# EAGLE design FoneAstra3.2 (EAGLE 6.3)

## Sheet 1 of 2
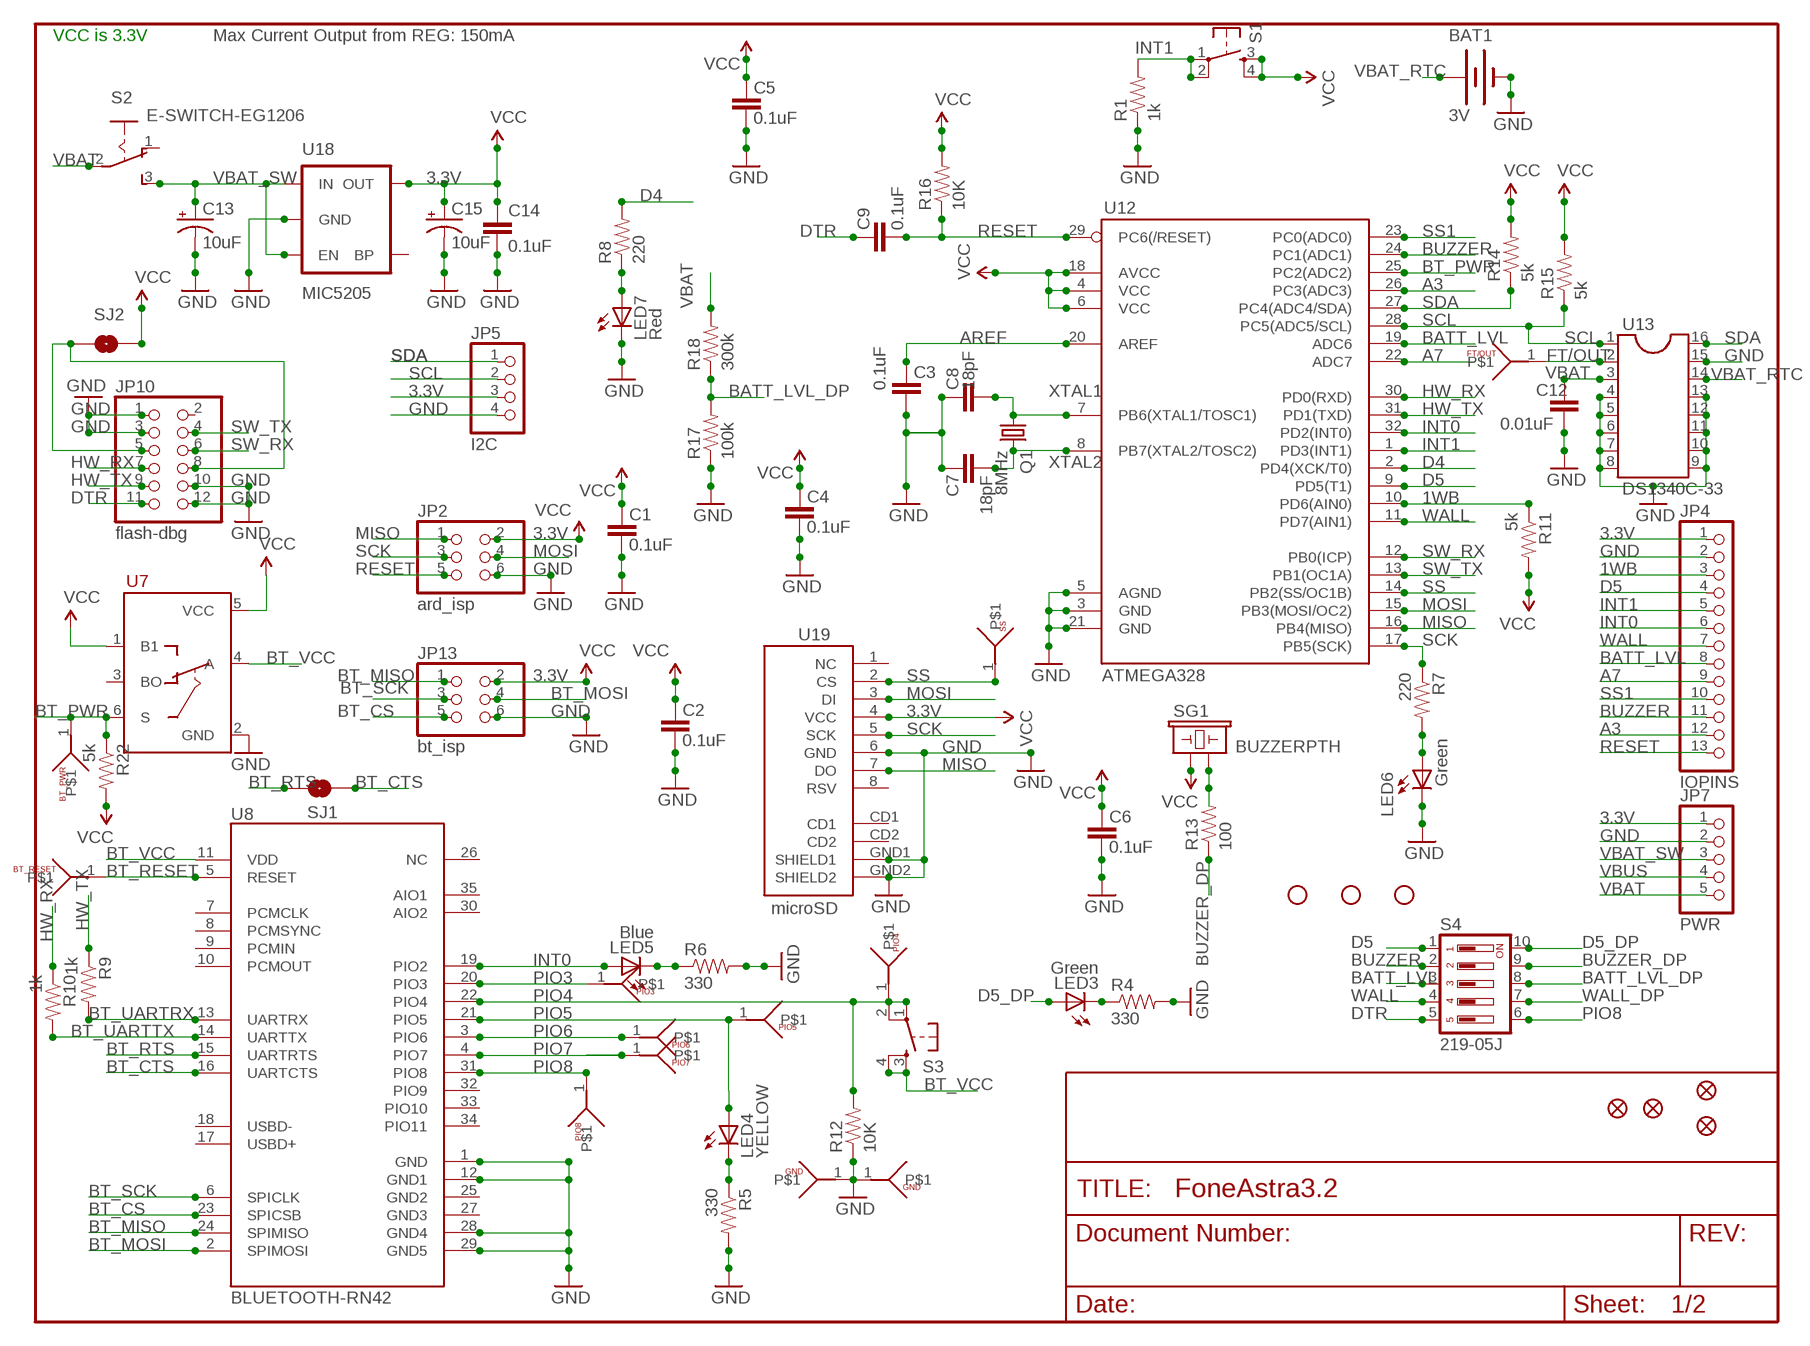
[diagram p0: schematic, sheet 1, part 1 of 2]
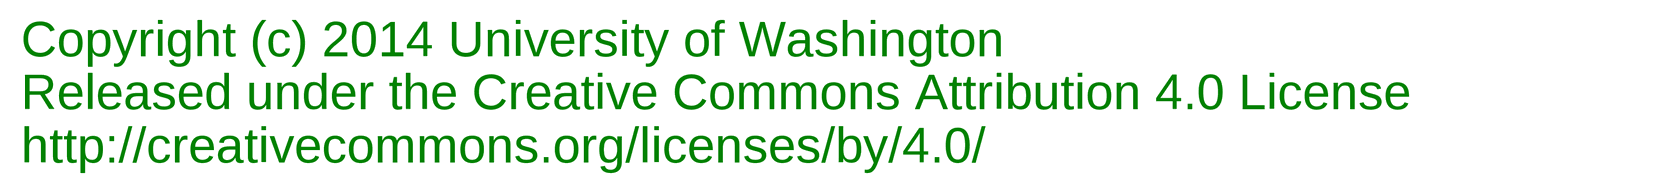
[diagram p1: schematic, sheet 1, part 2 of 2]

### Parts
$$U3  BT_RESET  TESTPOINT  [TESTPOINT]
$$U4  PIO6  TESTPOINT  [TESTPOINT]
$$U5  PIO7  TESTPOINT  [TESTPOINT]
$$U6  GND  TESTPOINT  [TESTPOINT]
$$U9  PIO4  TESTPOINT  [TESTPOINT]
$$U10  PIO3  TESTPOINT  [TESTPOINT]
$$U11  PIO5  TESTPOINT  [TESTPOINT]
$$U15  FT/OUT  TESTPOINT  [TESTPOINT]
$$U16  GND  TESTPOINT  [TESTPOINT]
BAT1  3V  BATTERY  [BATTCON_12MM_CURVED]
BT_PWR  BT_PWR  TESTPOINT  [TESTPOINT]
C1  0.1uF  CAP0402-CAP  [0402-CAP]
C2  0.1uF  CAP0402-CAP  [0402-CAP]
C3  0.1uF  CAP0402-CAP  [0402-CAP]
C4  0.1uF  CAP0402-CAP  [0402-CAP]
C5  0.1uF  CAP0402-CAP  [0402-CAP]
C6  0.1uF  CAP0402-CAP  [0402-CAP]
C7  18pF  CAP0402-CAP  [0402-CAP]
C8  18pF  CAP0402-CAP  [0402-CAP]
C9  0.1uF  CAP0402-CAP  [0402-CAP]
C12  0.01uF  CAP0402-CAP  [0402-CAP]
C13  10uF  CAP_POL1206  [EIA3216]
C14  0.1uF  CAP0402-CAP  [0402-CAP]
C15  10uF  CAP_POL1206  [EIA3216]
JP1  SPARKFUN_FIDUCIAL1.5X3  [SPARKFUN_FIDUCIAL-1.5X3]
JP2  ard_isp  PINHD-2X3  [2X03]
JP3  STAND-OFFTIGHT  [STAND-OFF-TIGHT]
JP4  IOPINS  PINHD-1X13M  [1X13M]
JP5  I2C  PINHD-1X4M  [1X04M]
JP6  STAND-OFFTIGHT  [STAND-OFF-TIGHT]
JP7  PWR  PINHD-1X5M  [1X05M]
JP8  SPARKFUN_FIDUCIAL1.5X3  [SPARKFUN_FIDUCIAL-1.5X3]
JP9  STAND-OFFTIGHT  [STAND-OFF-TIGHT]
JP10  flash-dbg  PINHD-2X6  [2X06]
JP11  SPARKFUN_FIDUCIAL1.5X3  [SPARKFUN_FIDUCIAL-1.5X3]
JP13  bt_isp  PINHD-2X3  [2X03]
JP14  SPARKFUN_FIDUCIAL1.5X3  [SPARKFUN_FIDUCIAL-1.5X3]
LED3  Green  LED0603  [LED-0603]
LED4  YELLOW  LED0603  [LED-0603]
LED5  Blue  LED0603  [LED-0603]
LED6  Green  LED0603  [LED-0603]
LED7  Red  LED0603  [LED-0603]
PIO8  PIO8  TESTPOINT  [TESTPOINT]
Q1  8MHz  CRYSTALHC49S  [HC49/S]
R1  1k  RESISTOR0402-RES  [0402-RES]
R4  330  RESISTOR0402-RES  [0402-RES]
R5  330  RESISTOR0402-RES  [0402-RES]
R6  330  RESISTOR0402-RES  [0402-RES]
R7  220  RESISTOR0402-RES  [0402-RES]
R8  220  RESISTOR0402-RES  [0402-RES]
R9  1k  RESISTOR0402-RES  [0402-RES]
R10  1k  RESISTOR0402-RES  [0402-RES]
R11  5k  RESISTOR0402-RES  [0402-RES]
R12  10K  RESISTOR0402-RES  [0402-RES]
R13  100  RESISTOR0402-RES  [0402-RES]
R14  5k  RESISTOR0402-RES  [0402-RES]
R15  5k  RESISTOR0402-RES  [0402-RES]
R16  10K  RESISTOR0402-RES  [0402-RES]
R17  100k  RESISTOR0402-RES  [0402-RES]
R18  300k  RESISTOR0402-RES  [0402-RES]
R22  5k  RESISTOR0402-RES  [0402-RES]
S1  switch  SPARKFUN_TAC_SWITCHPTH  [SPARKFUN_TACTILE-PTH]
S2  E-SWITCH-EG1206  [EG1206]
S3  Reset  TAC_SWITCHSMD  [TACTILE_SWITCH_SMD]
S4  219-05J  [CTS-219-05J]
SG1  BUZZERPTH  [BUZZER-12MM]
SJ1  SOLDERJUMPERNC2  [SJ_2S-NOTRACE]
SJ2  SOLDERJUMPERNC2  [SJ_2S-NOTRACE]
SS  SS  TESTPOINT  [TESTPOINT]
U7  FSA4157AP6X  [SC70-6]
U8  BLUETOOTH-RN42  BLUETOOTH-RN41"  [RN41]
U12  ATMEGA328  ATMEGA168  [TQFP32-08]
U13  DS1340C-33  [SO16L]
U18  MIC5205  V_REG_LDOSMD  [SOT23-5]
U19  microSD  USD-SOCKETSMD  [MICRO-SD-SOCKET-PP]

### Nets
1WB: JP4.3 R11.1 U12.10(PD6(AIN0)) ; also sheet 2
3.3V: C1.2 C2.2 C4.2 C5.2 C6.2 C14.1 C15.A(+) JP2.2 JP4.1 JP5.3 JP7.1 JP13.2 R11.2 R14.2 R15.2 R16.2 R22.2 S1.3 S1.4 SG1.+ SJ2.1 U7.1(B1) U7.5(VCC) U12.4(VCC) U12.6(VCC) U12.18(AVCC) U18.5(OUT) U19.4(VCC) ; supply symbol labelled VCC ; also sheet 2
A3: JP4.12 U12.26(PC3(ADC3))
A7: JP4.9 U12.22(ADC7)
AREF: C3.2 U12.20(AREF)
BATT_LVL: JP4.8 S4.3 U12.19(ADC6)
BATT_LVL_DP: R17.2 R18.1 S4.8
BT_CS: JP13.5 U8.23(SPICSB)
BT_CTS: SJ1.1 U8.16(UARTCTS)
BT_MISO: JP13.1 U8.24(SPIMISO)
BT_MOSI: JP13.4 U8.2(SPIMOSI)
BT_PWR: BT_PWR.1 R22.1 U7.6(S) U12.25(PC2(ADC2))
BT_RESET: $$U3.1 U8.5(RESET)
BT_RTS: SJ1.2 U8.15(UARTRTS)
BT_SCK: JP13.3 U8.6(SPICLK)
BT_UARTRX: R9.2 U8.13(UARTRX)
BT_UARTTX: R10.2 U8.14(UARTTX)
BT_VCC: S3.3 S3.4 U7.4(A) U8.11(VDD)
BUZZER: JP4.11 S4.2 U12.24(PC1(ADC1))
BUZZER_DP: R13.1 S4.9
D1: LED4.C R5.1
D4: R8.2 U12.2(PD4(XCK/T0))
D5: JP4.4 S4.1 U12.9(PD5(T1))
D5_DP: LED3.A S4.10
DTR: C9.2 JP10.11 S4.5
FT/OUT: $$U15.1 U13.2
GND: $$U6.1 $$U16.1 BAT1.GND(-) C1.1 C2.1 C3.1 C4.1 C5.1 C6.1 C7.2 C8.2 C12.1 C13.C(-) C14.2 C15.C(-) JP2.6 JP4.2 JP5.4 JP7.2 JP10.1 JP10.3 JP10.10 JP10.12 JP13.6 LED6.C LED7.C R1.1 R4.2 R5.2 R6.2 R12.1 R17.1 U7.2(GND) U8.1(GND) U8.12(GND1) U8.28(GND4) U8.29(GND5) U12.3(GND) U12.5(AGND) U12.21(GND) U13.4 U13.5 U13.6 U13.7 U13.8 U13.9 U13.10 U13.11 U13.12 U13.13 U13.15 U18.2(GND) U19.6(GND) U19.GND1(SHIELD1) U19.GND2(SHIELD2) ; also sheet 2
HW_RX: JP10.7 R10.1 U12.30(PD0(RXD))
HW_TX: JP10.9 R9.1 U12.31(PD1(TXD))
INT0: JP4.6 LED5.A U8.19(PIO2) U12.32(PD2(INT0))
INT1: JP4.5 R1.2 S1.1 S1.2 U12.1(PD3(INT1))
MISO: JP2.1 U12.16(PB4(MISO)) U19.7(DO)
MOSI: JP2.4 U12.15(PB3(MOSI/OC2)) U19.3(DI)
N$1: R13.2 SG1.-
N$2: JP10.5 JP10.8 SJ2.2
N$5: LED3.C R4.1
N$7: LED6.A R7.2
N$8: LED5.C R6.1
N$38: LED7.A R8.1
PIO3: $$U10.1 U8.20(PIO3)
PIO4: $$U9.1 R12.2 S3.1 S3.2 U8.22(PIO4)
PIO5: $$U11.1 LED4.A U8.21(PIO5)
PIO6: $$U4.1 U8.3(PIO6)
PIO7: $$U5.1 U8.4(PIO7)
PIO8: PIO8.1 S4.6 U8.31(PIO8)
RESET: C9.1 JP2.5 JP4.13 R16.1 U12.29(PC6(/RESET))
SCK: JP2.3 R7.1 U12.17(PB5(SCK)) U19.5(SCK)
SCL: JP5.2 R15.1 U12.28(PC5(ADC5/SCL)) U13.1
SDA: JP5.1 R14.1 U12.27(PC4(ADC4/SDA)) U13.16
SS: SS.1 U12.14(PB2(SS/OC1B)) U19.2(CS)
SS1: JP4.10 U12.23(PC0(ADC0))
SW_RX: JP10.6 U12.12(PB0(ICP))
SW_TX: JP10.4 U12.13(PB1(OC1A))
VBAT: C12.2 JP7.5 R18.2 S2.2(P) U13.3 ; also sheet 2
VBAT_RTC: BAT1.PWR@1(+) U13.14
VBAT_SW: C13.A(+) JP7.3 S2.3(S) U18.1(IN) U18.3(EN)
VBUS: JP7.4 ; also sheet 2
WALL: JP4.7 S4.4 U12.11(PD7(AIN1))
WALL_DP: S4.7 ; also sheet 2
XTAL1: C8.1 Q1.1 U12.7(PB6(XTAL1/TOSC1))
XTAL2: C7.1 Q1.2 U12.8(PB7(XTAL2/TOSC2))
Unconnected: JP10.2 S2.1(O) U7.3(BO) U8.7(PCMCLK) U8.8(PCMSYNC) U8.9(PCMIN) U8.10(PCMOUT) U8.17(USBD+) U8.18(USBD-) U8.25(GND2) U8.26(NC) U8.27(GND3) U8.30(AIO2) U8.32(PIO9) U8.33(PIO10) U8.34(PIO11) U8.35(AIO1) U18.4(BP) U19.1(NC) U19.8(RSV) U19.CD1 U19.CD2

### Notes on the sheet
- VCC is 3.3V | Max Current Output from REG: 150mA
- Copyright (c) 2014 University of Washington
  Released under the Creative Commons Attribution 4.0 License
  http://creativecommons.org/licenses/by/4.0/

## Sheet 2 of 2
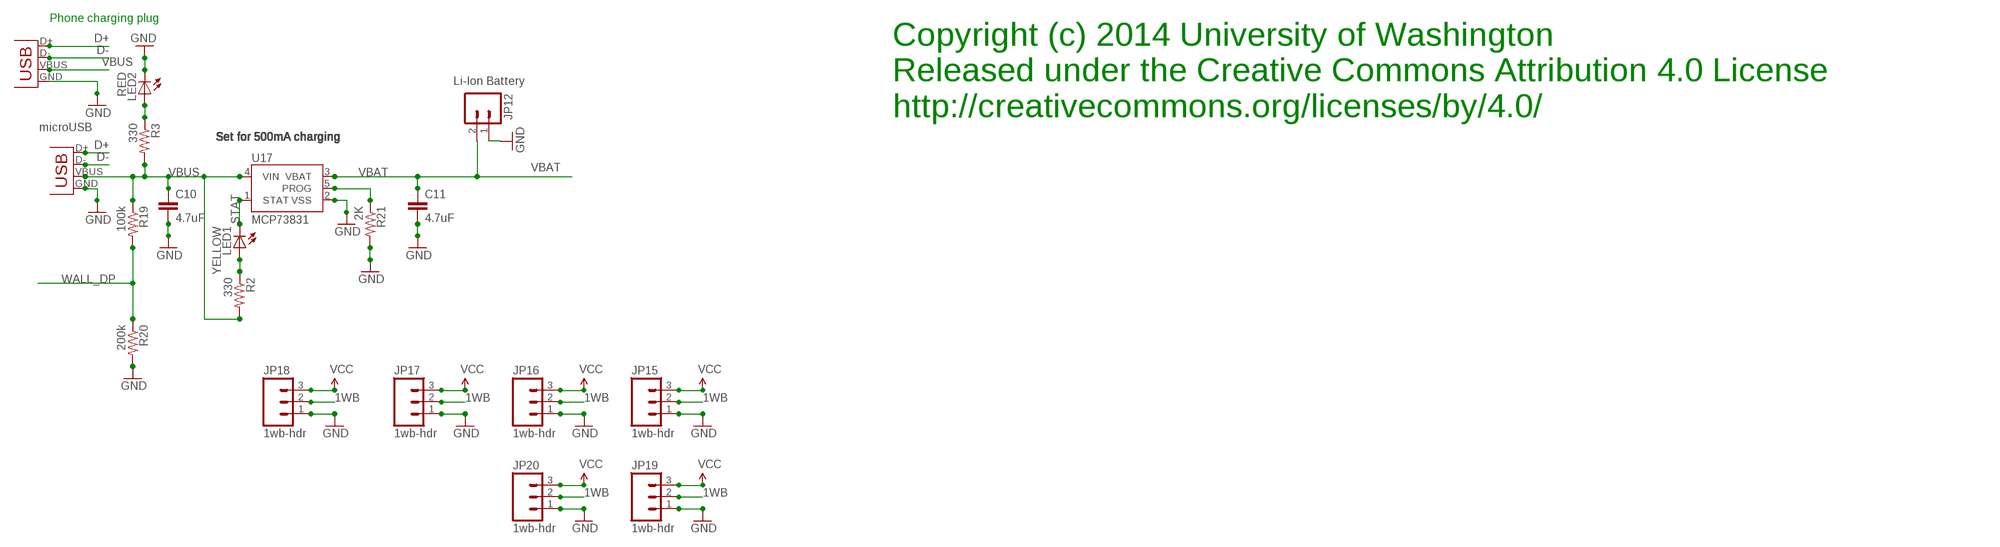
[diagram p2: schematic, sheet 2]

### Parts
C10  4.7uF  CAP0402-CAP  [0402-CAP]
C11  4.7uF  CAP0402-CAP  [0402-CAP]
JP12  Li-Ion Battery  SPARKFUN_M02JST-PTH-2  [SPARKFUN_JST-2-PTH]
JP15  1wb-hdr  M03JST-PTH  [JST-3-PTH]
JP16  1wb-hdr  M03JST-PTH  [JST-3-PTH]
JP17  1wb-hdr  M03JST-PTH  [JST-3-PTH]
JP18  1wb-hdr  M03JST-PTH  [JST-3-PTH]
JP19  1wb-hdr  M03JST-PTH  [JST-3-PTH]
JP20  1wb-hdr  M03JST-PTH  [JST-3-PTH]
LED1  YELLOW  LED0603  [LED-0603]
LED2  RED  LED0603  [LED-0603]
R2  330  RESISTOR0402-RES  [0402-RES]
R3  330  RESISTOR0402-RES  [0402-RES]
R19  100k  RESISTOR0402-RES  [0402-RES]
R20  200k  RESISTOR0402-RES  [0402-RES]
R21  2K  RESISTOR0402-RES  [0402-RES]
U17  MCP73831  [SOT23-5]
X1  Micro USB  USB-MICROB  [USB-MICROB]
X2  Micro USB  USB-MICROB  [USB-MICROB]

### Nets
1WB: JP15.2 JP16.2 JP17.2 JP18.2 JP19.2 JP20.2 ; also sheet 1
3.3V: JP15.3 JP16.3 JP17.3 JP18.3 JP19.3 JP20.3 ; supply symbol labelled VCC ; also sheet 1
D+: X1.D+ X2.D+
D-: X1.D- X2.D-
GND: C10.2 C11.2 JP12.1 JP15.1 JP16.1 JP17.1 JP18.1 JP19.1 JP20.1 LED2.C R20.2 R21.2 U17.2(VSS) X1.GND X2.GND ; also sheet 1
N$9: LED2.A R3.1
N$11: LED1.A R2.1
PROG: R21.1 U17.5(PROG)
STAT: LED1.C U17.1(STAT)
VBAT: C11.1 JP12.2 U17.3(VBAT) ; also sheet 1
VBUS: C10.1 R2.2 R3.2 R19.1 U17.4(VIN) X1.VBUS X2.VBUS ; also sheet 1
WALL_DP: R19.2 R20.1 ; also sheet 1

### Notes on the sheet
- Phone charging plug
- Copyright (c) 2014 University of Washington
  Released under the Creative Commons Attribution 4.0 License
  http://creativecommons.org/licenses/by/4.0/
- microUSB
- Set for 500mA charging | Set for 500mA charging | Set for 500mA charging | Set for 500mA charging | Set for 500mA charging | Set for 500mA charging | Set for 500mA charging | Set for 500mA charging | Set for 500mA charging | Set for 500mA charging | Set for 500mA charging | Set for 500mA charging

## Library data of the parts
$$U3-$$U6 $$U9-$$U11 $$U15 $$U16 BT_PWR PIO8 SS = FoneAstra3.0_v3:TESTPOINT
BAT1 = SparkFun:BATTERY: Battery Holders Various common sizes : AA, AAA, 20mm coin cell and 12mm coin cell.
C1-C12 C14 = SparkFun:CAP: Capacitor Standard 0603 ceramic capacitor, and 0.1" leaded capacitor.
C13 C15 = SparkFun:CAP_POL: Capacitor Polarized These are standard SMD and PTH capacitors. Normally 10uF, 47uF, and 100uF in electrolytic and tantalum varieties. Always verify the external diameter of the through hole cap, it varies with capacity, voltage, and manufacturer. The EIA devices should be standard.
JP1 JP8 JP11 JP14 = FoneAstra3.0_v2:SPARKFUN_FIDUCIAL: Fiducial Alignment Points Various fiducial points for machine vision alignment.
JP2 JP13 = pinhead:PINHD-2X3: PIN HEADER
JP3 JP6 JP9 = SparkFun-Electromechanical:STAND-OFF: #4 Stand Off This is the mechanical footprint for a #4 phillips button head screw. Use the keepout ring to avoid running the screw head into surrounding components. SKU : PRT-00447
JP4 = FoneAstra3.0_v3:PINHD-1X13: PIN HEADER
JP5 = FoneAstra3.0_v3:PINHD-1X4: PIN HEADER
JP7 = FoneAstra3.0_v3:PINHD-1X5: PIN HEADER
JP10 = pinhead:PINHD-2X6: PIN HEADER
JP12 = FoneAstra3.0_v2:SPARKFUN_M02: Header 2 Standard 2-pin 0.1" header. Use with straight break away headers (SKU : PRT-00116), right angle break away headers (PRT-00553), swiss pins (PRT-00743), machine pins (PRT-00117), and female headers (PRT-00115). Molex polarized connector foot print use with SKU : PRT-08233 with associated crimp pins and housings.
JP15-JP20 = SparkFun-Connectors:M03: Header 3 Standard 3-pin 0.1" header. Use with straight break away headers (SKU : PRT-00116), right angle break away headers (PRT-00553), swiss pins (PRT-00743), machine pins (PRT-00117), and female headers (PRT-00115). Molex polarized connector foot print use with SKU : PRT-08232 with associated crimp pins and housings.
LED1-LED7 = SparkFun:LED: LEDs Standard schematic elements and footprints for 5mm, 3mm, 1206, and 0603 sized LEDs. 5mm - Spark Fun Electronics SKU : COM-00529 (and others)
Q1 = crystal:CRYSTAL: CRYSTAL; OC_FARNELL: 1667008; OC_NEWARK: unknown
R1-R22 = SparkFun:RESISTOR: Resistor Basic schematic elements and footprints for 0603, 1206, and PTH resistors.
S1 = FoneAstra3.0_v2:SPARKFUN_TAC_SWITCH: Momentary Switch Button commonly used for reset or general input. Spark Fun Electronics SKU : COM-00097
S2 = FoneAstra3.0_v2:E-SWITCH-EG1206
S3 = SparkFun:TAC_SWITCH: Momentary Switch Button commonly used for reset or general input. Spark Fun Electronics SKU : COM-00097
S4 = switch-dil:219-05*: Surface Mount DIP Switch Series 219 SMT CTS Electronic Components Sourc: www.ctscorp.com; OC_FARNELL: unknown; OC_NEWARK: unknown
SG1 = SparkFun-Electromechanical:BUZZER: Buzzer 12mm Spark Fun Electronics SKU : Comp-Buzzer
SJ1 SJ2 = SparkFun:SOLDERJUMPER: Solder Jumper Standard SMD solder jumper. Used to automate production. Two varients : Normally Open and Normally Closed are the same, but have different paste layers. NC will have a large amount of paste and should jumper during reflow.
U7 = FoneAstra3.0_v4:FSA4157AP6X
U8 = SparkFun:BLUETOOTH-RN41
U12 = SparkFun:ATMEGA168
U13 = FoneAstra3.0_v2:DS1340C-33
U17 = SparkFun:MCP73831: Microchip's MCP73831 Miniature single cell, fully integrated Li-Ion, Li-polymer charge management controller http://ww1.microchip.com/downloads/en/DeviceDoc/21984a.pdf
U18 = SparkFun:V_REG_LDO: Voltage Regulator LDO Standard 150mA LDO voltage regulator in SOT-23 layout. Micrel part MIC5205. BP (by-pass) pin is used to lower output noise with 470pF cap.
U19 = SparkFun:USD-SOCKET: microSD Socket Push-push type uSD socket. Schematic element and footprint production proven. Spark Fun Electronics SKU : PRT-00127. tDoc lines correctly indicate media card edge positions when inserting (unlocked, locked, depressed).
X1 X2 = SparkFun:USB: USB Connectors USB-B-PTH is fully proven SKU : PRT-00139 USB-miniB is fully proven SKU : PRT-00587 USB-A-PCB is untested. USB-A-H is throughly reviewed, but untested. Spark Fun Electronics SKU : PRT-00437 USB-B-SMT is throughly reviewed, but untested. Needs silkscreen touching up. USB-A-S has not been used/tested USB-MB-H has not been used/tested

## Net classes
1 vcc: width 0.254 mm

## Board
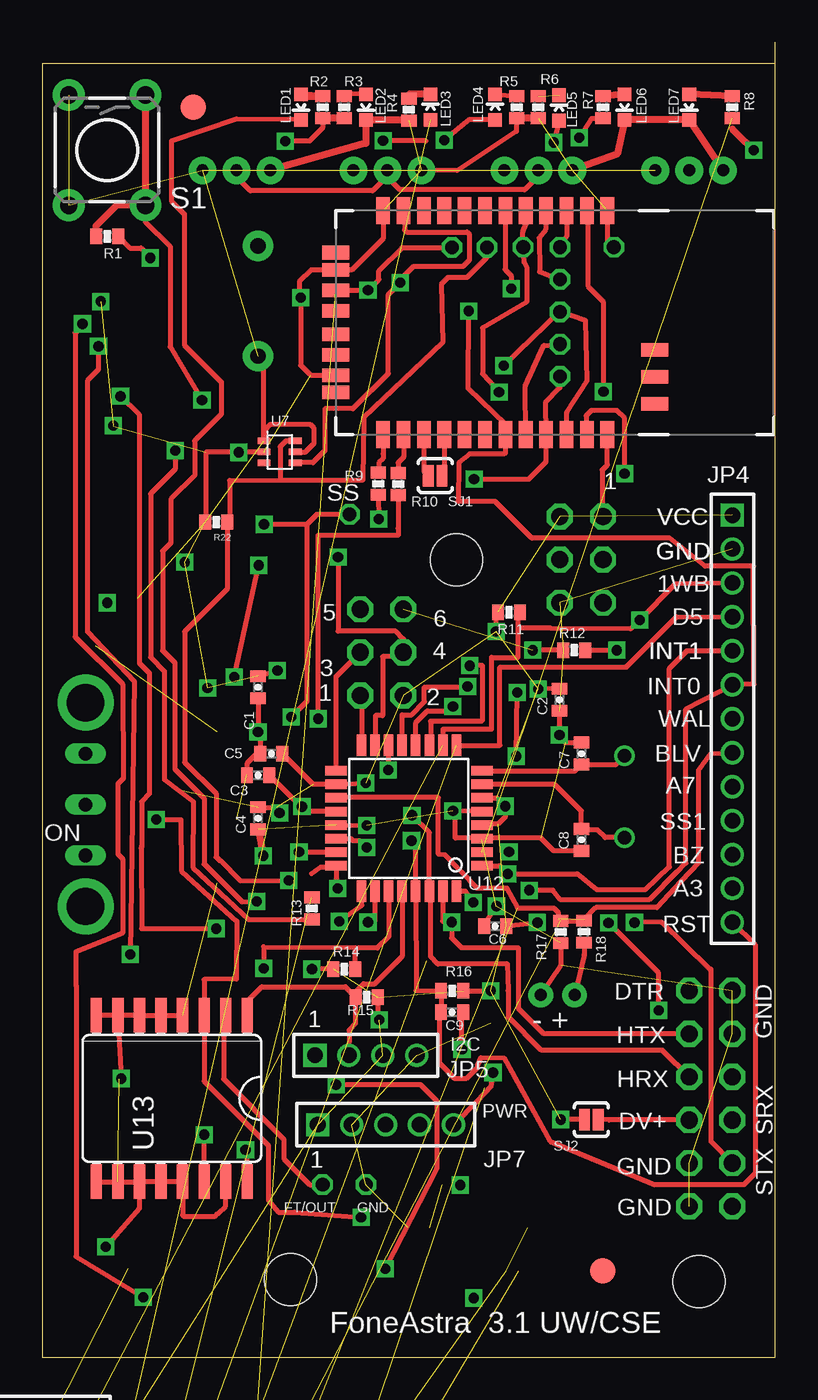
[diagram p3: board, top side]
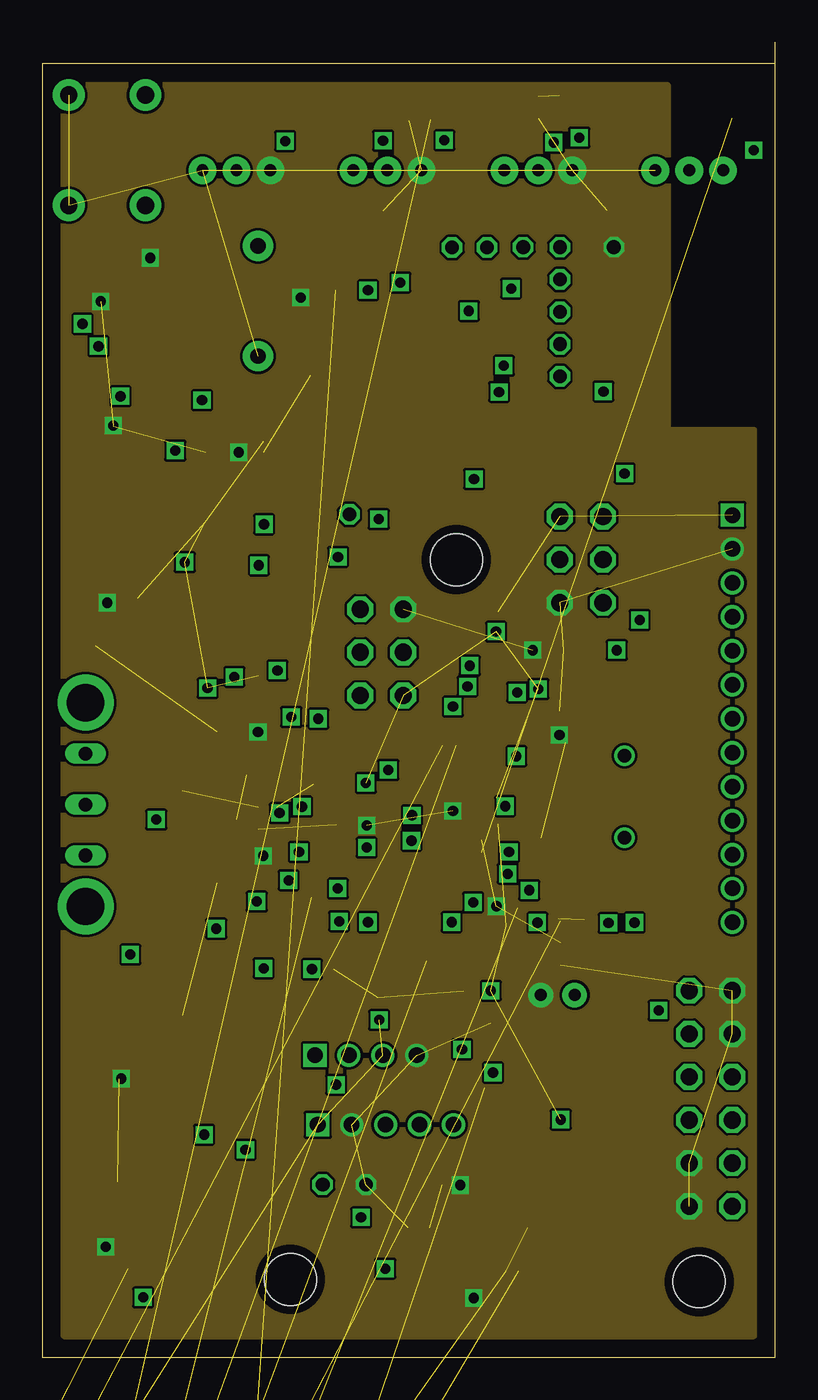
[diagram p4: board, inner layer Route2]
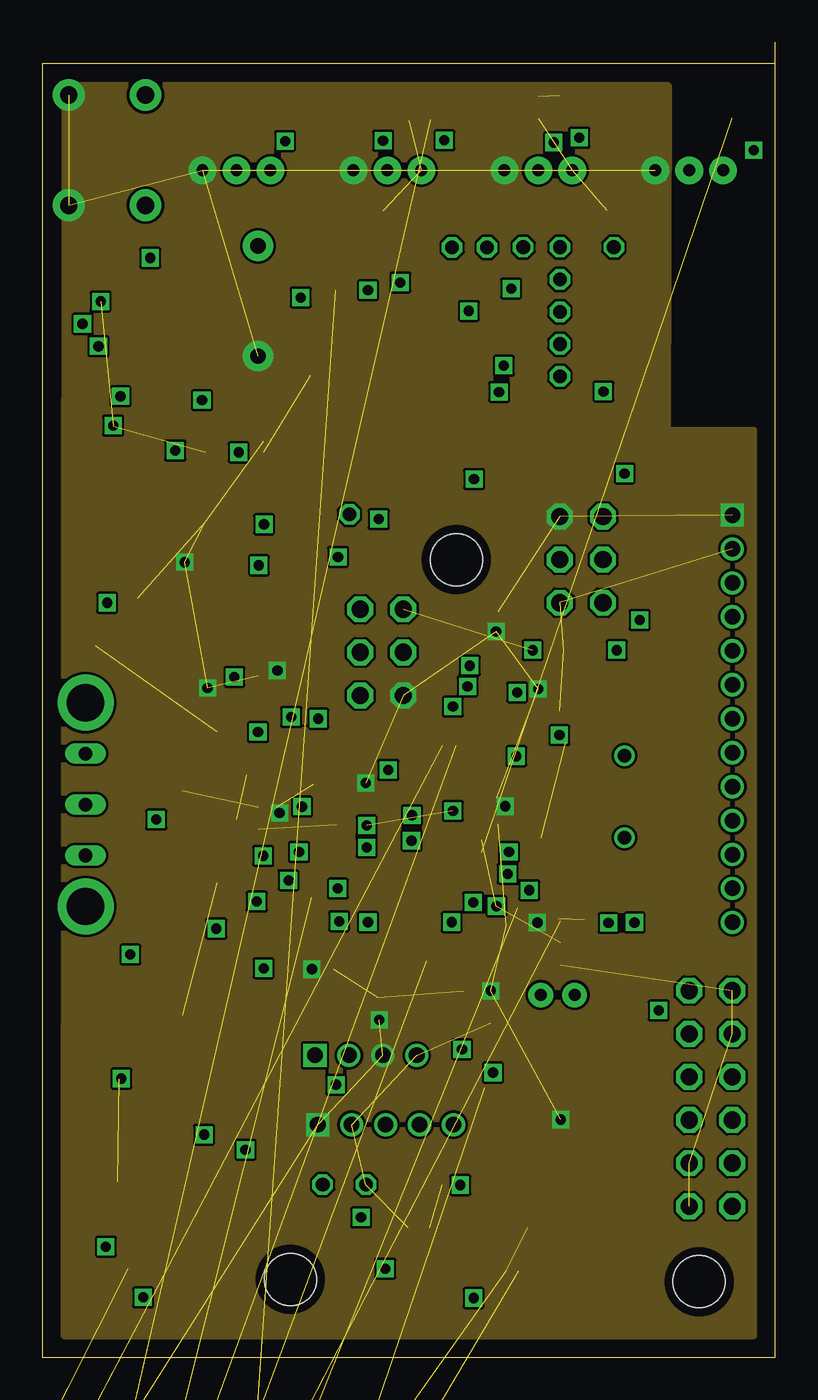
[diagram p5: board, inner layer Route15]
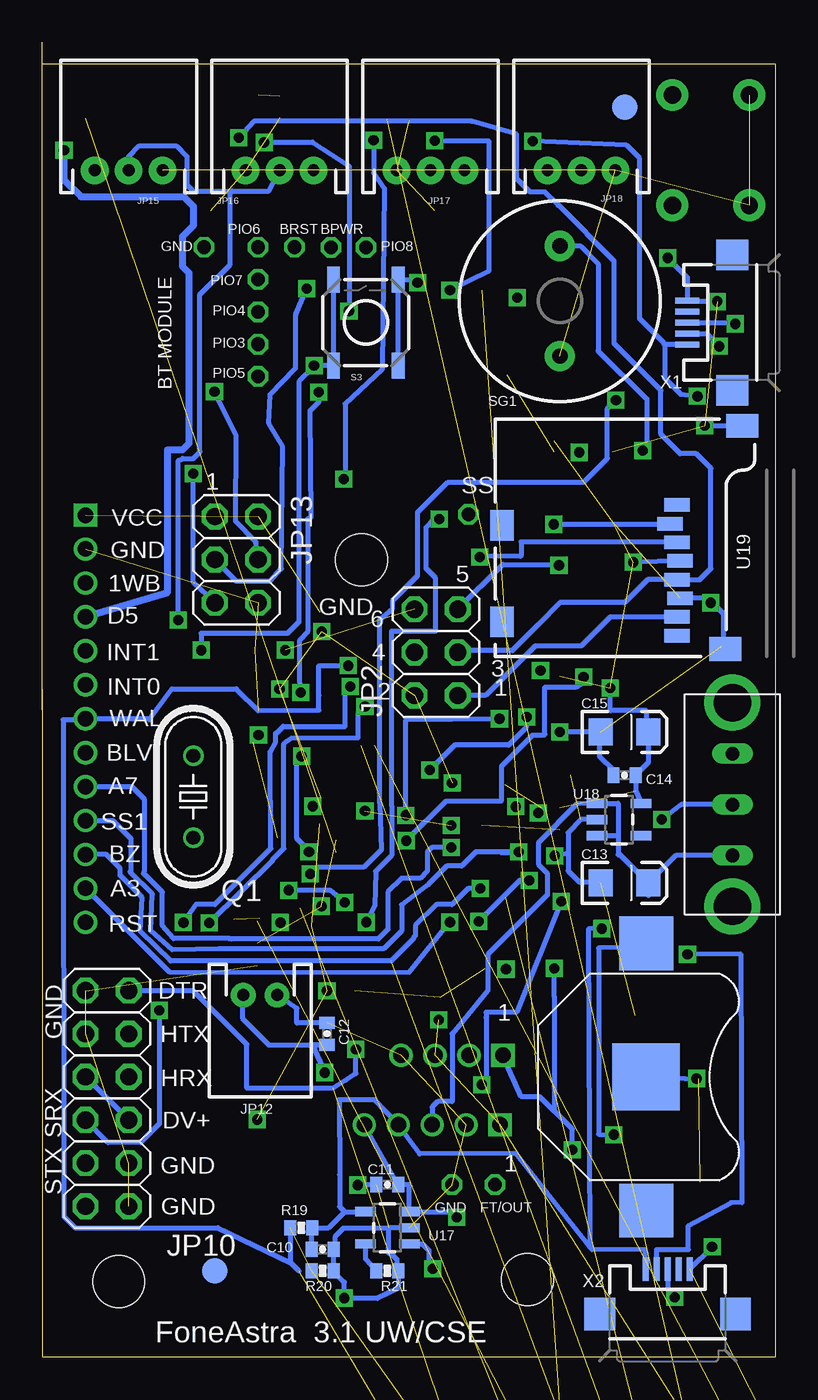
[diagram p6: board, bottom side, seen from below]

Size 43.18 x 77.47 mm. Coordinates in mm from the lower left corner, seen from the top.
Outline: 43.16,1.27 43.18,77.47
Outline: 0,0 43.16,0 43.18,76.2 0,76.2 0,0
Copper layers (1+2*15+16): Top 0.0178mm / dielectric 12mil / Route2 0.0356mm / dielectric 28mil / Route15 0.0356mm / dielectric 12mil / Bottom 0.0178mm
Design rules "default": minimum track width 6mil, minimum drill 8mil, track to track 6mil, track to pad 6mil, pad to pad 6mil, via to via 6mil, smd to smd 6mil, copper to edge 20mil, drill to drill 16mil, minimum pad ring 8mil, minimum via ring 8mil, stop-mask expansion 3mil, vias tented up to drill 0mil, thermal gap 10mil
tRestrict: area 37.1,54.6 to 43.2,67.3
bRestrict: area 36.8,54.6 to 43.2,67.3

### Footprints (pad centres in the part's own frame; a part is rotated, then mirrored left to right if it is on the bottom)
TESTPOINT = drill 0.8 octagon: 1 0,0
BATTCON_12MM_CURVED = smd 3.962 x 3.962: GND 0,0 | smd 3.175 x 3.175: PWR@1 -7.874,0; PWR@2 7.874,0
0402-CAP = smd 0.7 x 0.9: 1 -0.65,0; 2 0.65,0
EIA3216 = smd 1.4 x 1.6: A 1.4,0; C -1.4,0
SPARKFUN_FIDUCIAL-1.5X3 = smd 1.5 x 1.5: 1 0,0
2X03 = drill 1.016 octagon: 1 -2.54,-1.27; 2 -2.54,1.27; 3 0,-1.27; 4 0,1.27; 5 2.54,-1.27; 6 2.54,1.27
STAND-OFF-TIGHT = hole 3.048: 0,0
1X13M = drill 0.914 square: 1 -12,0 | drill 0.914: 2 -10,0; 3 -8,0; 4 -6,0; 5 -4,0; 6 -2,0; 7 0,0; 8 2,0; 9 4,0; 10 6,0; 11 8,0; 12 10,0; 13 12,0
1X04M = drill 0.914 square: 1 -3,0 | drill 0.914: 2 -1,0; 3 1,0; 4 3,0
1X05M = drill 0.914 square: 1 -4,0 | drill 0.914: 2 -2,0; 3 0,0; 4 2,0; 5 4,0
2X06 = drill 1.016 octagon: 1 -6.35,-1.27; 2 -6.35,1.27; 3 -3.81,-1.27; 4 -3.81,1.27; 5 -1.27,-1.27; 6 -1.27,1.27; 7 1.27,-1.27; 8 1.27,1.27; 9 3.81,-1.27; 10 3.81,1.27; 11 6.35,-1.27; 12 6.35,1.27
SPARKFUN_JST-2-PTH = drill 0.7 pad 1.448: 1 -1,0; 2 1,0
JST-3-PTH = drill 0.7 pad 1.626: 1 -2,-5; 2 0,-5; 3 2,-5
LED-0603 = smd 0.8 x 0.8: A 0,-0.75; C 0,0.75
HC49/S = drill 0.813: 1 -2.413,0; 2 2.413,0
0402-RES = smd 0.7 x 0.9: 1 -0.65,0; 2 0.65,0
SPARKFUN_TACTILE-PTH = drill 1.016 pad 1.88: 1 -3.251,2.261; 2 3.251,2.261; 3 -3.251,-2.261; 4 3.251,-2.261
EG1206 = drill 0.8 long: 1 0,0; 2 3,0; 3 6,0 | drill 2.2 pad 2.54: P$4 -3,0; P$5 9,0
TACTILE_SWITCH_SMD = smd 1.524 x 0.762: 1 -2.54,1.905; 2 2.54,1.905; 3 -2.54,-1.905; 4 2.54,-1.905
CTS-219-05J = smd 1.13 x 2.44: 1 -5.08,-3.215; 2 -2.54,-3.215; 3 0,-3.215; 4 2.54,-3.215; 5 5.08,-3.215; 6 5.08,3.215; 7 2.54,3.215; 8 0,3.215; 9 -2.54,3.215; 10 -5.08,3.215
BUZZER-12MM = drill 0.9 pad 1.778: + 3.25,0; - -3.25,0
SJ_2S-NOTRACE = smd 0.635 x 1.27: 1 -0.401,0; 2 0.413,0
SC70-6 = smd 0.4 x 0.75: 1 -0.65,-0.925; 2 0,-0.925; 3 0.65,-0.925; 4 0.65,0.925; 5 0,0.925; 6 -0.65,0.925
RN41 = smd 0.8 x 1.6: 1 -6.6,-6.6; 2 -5.4,-6.6; 3 -4.2,-6.6; 4 -3,-6.6; 5 -1.8,-6.6; 6 -0.6,-6.6; 7 0.6,-6.6; 8 1.8,-6.6; 9 3,-6.6; 10 4.2,-6.6; 11 5.4,-6.6; 12 6.6,-6.6; 13 6.6,6.6; 14 5.4,6.6; 15 4.2,6.6; 16 3,6.6; 17 1.8,6.6; 18 0.6,6.6; 19 -0.6,6.6; 20 -1.8,6.6; 21 -3,6.6; 22 -4.2,6.6; 23 -5.4,6.6; 24 -6.6,6.6 | smd 1.6 x 0.8: 25 -9.4,4.8; 26 -9.4,3.2; 27 -9.4,1.6; 28 9.4,3.1; 29 9.4,-3.1; 30 9.4,-4.122; 31 9.4,-1.9; 32 9.4,-0.7; 33 9.4,0.7; 34 9.4,1.9; 35 9.4,4.122
TQFP32-08 = smd 1.27 x 0.559: 1 -4.293,2.8; 2 -4.293,2; 3 -4.293,1.2; 4 -4.293,0.4; 5 -4.293,-0.4; 6 -4.293,-1.2; 7 -4.293,-2; 8 -4.293,-2.8; 17 4.293,-2.8; 18 4.293,-2; 19 4.293,-1.2; 20 4.293,-0.4; 21 4.293,0.4; 22 4.293,1.2; 23 4.293,2; 24 4.293,2.8 | smd 0.559 x 1.27: 9 -2.8,-4.293; 10 -2,-4.293; 11 -1.2,-4.293; 12 -0.4,-4.293; 13 0.4,-4.293; 14 1.2,-4.293; 15 2,-4.293; 16 2.8,-4.293; 25 2.8,4.293; 26 2,4.293; 27 1.2,4.293; 28 0.4,4.293; 29 -0.4,4.293; 30 -1.2,4.293; 31 -2,4.293; 32 -2.8,4.293
SO16L = smd 0.66 x 2.032: 1 -4.445,-4.902; 2 -3.175,-4.902; 3 -1.905,-4.902; 4 -0.635,-4.902; 5 0.635,-4.902; 6 1.905,-4.902; 7 3.175,-4.902; 8 4.445,-4.902; 9 4.445,4.902; 10 3.175,4.902; 11 1.905,4.902; 12 0.635,4.902; 13 -0.635,4.902; 14 -1.905,4.902; 15 -3.175,4.902; 16 -4.445,4.902
SOT23-5 = smd 0.55 x 1.2: 1 -0.95,-1.3; 2 0,-1.3; 3 0.95,-1.3; 4 0.95,1.3; 5 -0.95,1.3
MICRO-SD-SOCKET-PP = smd 0.8 x 1.5: 1 -8.94,10.7; 2 -7.84,10.3; 3 -6.74,10.7; 4 -5.64,10.9; 5 -4.54,10.7; 6 -3.44,10.9; 7 -2.34,10.7; 8 -1.24,10.7 | smd 1.8 x 1.4: CD1 -7.75,0.4; CD2 -2.05,0.4 | smd 1.4 x 1.9: GND1 -13.6,14.55; GND2 -0.45,13.55
USB-MICROB = smd 0.35 x 1.4: D+ 0,2.65; D- -0.65,2.65; GND 1.3,2.65; ID 0.65,2.65; VBUS -1.3,2.65 | smd 1.8 x 1.9: MT1 -4,0; MT2 4,0

### Placement (x,y rotation side)
$$U3  28.32,65.41 0 top
$$U4  30.48,65.41 0 top
$$U5  30.48,63.5 0 top
$$U6  33.66,65.41 0 top
$$U9  30.48,61.59 0 top
$$U10  30.48,59.69 0 top
$$U11  30.48,57.78 0 top
$$U15  16.51,10.16 0 top
$$U16  19.05,10.16 0 top
BAT1  7.62,16.51 270 bottom
BT_PWR  26.19,65.38 0 top
C1  12.7,39.47 90 top
C2  30.45,38.73 90 top
C3  12.7,34.29 0 top
C4  12.7,31.75 90 top
C5  13.49,35.56 0 top
C6  26.67,25.4 0 top
C7  31.75,35.56 90 top
C8  31.75,30.48 270 top
C9  24.13,20.32 0 top
C10  26.67,6.35 0 bottom
C11  22.86,10.16 180 bottom
C12  26.42,19.05 270 bottom
C13  8.89,27.94 0 bottom
C14  8.89,34.29 180 bottom
C15  8.89,36.83 0 bottom
JP1  8.89,73.66 90 top
JP2  19.99,41.53 90 bottom
JP3  24.38,46.99 0 top
JP4  40.64,37.62 270 top
JP5  19.05,17.78 0 top
JP6  14.61,4.57 0 top
JP7  20.22,13.69 0 top
JP8  33.02,5.08 180 top
JP9  38.68,4.45 0 top
JP10  39.37,15.24 90 bottom
JP11  33.02,5.08 0 bottom
JP12  30.35,21.34 180 bottom
JP13  31.75,46.99 270 bottom
JP14  8.89,73.66 0 bottom
JP15  38.1,74.93 0 bottom
JP16  29.21,74.93 0 bottom
JP17  20.32,74.93 0 bottom
JP18  11.43,74.93 0 bottom
JP19  0,-3.81 0 top  (outside the outline)
JP20  0,-12.7 0 top  (outside the outline)
LED1  15.24,73.66 180 top
LED2  19.05,73.66 180 top
LED3  22.86,73.66 0 top
LED4  26.67,73.66 0 top
LED5  30.43,73.61 0 top
LED6  34.29,73.66 180 top
LED7  38.1,73.66 180 top
PIO8  24.13,65.38 0 top
Q1  34.29,33.02 90 bottom
R1  3.81,66.04 180 top
R2  16.51,73.66 270 top
R3  17.78,73.66 270 top
R4  21.59,73.51 270 top
R5  27.94,73.66 270 top
R6  29.21,73.66 270 top
R7  33.02,73.66 90 top
R8  40.64,73.66 270 top
R9  19.79,51.46 90 top
R10  20.95,51.44 90 top
R11  27.48,43.89 180 top
R12  31.32,41.66 0 top
R13  15.88,26.44 270 top
R14  17.78,22.86 180 top
R15  19.1,21.21 0 top
R16  24.13,21.59 0 top
R17  30.53,25.04 90 top
R18  31.9,25.07 270 top
R19  27.94,7.62 180 bottom
R20  26.67,5.08 0 bottom
R21  22.86,5.08 0 bottom
R22  10.24,49.2 180 top
S1  3.81,71.12 270 top
S2  2.54,35.56 270 bottom
S3  24.13,60.96 90 bottom
S4  6.35,-24.13 0 top  (outside the outline)
SG1  12.7,62.23 270 bottom
SJ1  23.14,51.94 180 top
SJ2  32.33,14 0 top
SS  18.08,49.66 0 top
U7  13.97,53.34 270 top
U8  26.67,60.96 180 top
U12  21.59,31.75 180 top
U13  7.62,15.24 180 top
U17  22.86,7.62 90 bottom
U18  9.22,31.67 270 bottom
U19  16.51,41.27 270 bottom
X1  2.54,60.96 90 bottom
X2  6.35,2.54 0 bottom

### Tracks (layer width: path | path; a pad name or v marks a point on that pad's centre or on a via)
1WB  (via drill 0.6)  (2 unrouted)
  Top 0.305: JP16.2 29.21,69.6 28.4,68.78 21.06,68.78 20.32,69.52 JP17.2 20.3,69.91 20.3,69.57 19.46,68.73 12.24,68.73 11.43,69.55 JP18.2 | U12.10 23.6,37.01 26.47,37.01 26.47,40.92 26.47,41.22 28.02,41.22 28.02,42.98 | JP4.3 37.29,45.54 v35.18,43.43 34.65,42.93 29.95,42.95 28.04,42.95 28.02,42.98 | 28.02,42.98 28.02,43.77 R11.1
  Bottom 0.305: v35.18,43.43 35.18,52.83 34.92,52.96 34.29,52.96 33.91,53.34 33.91,62.61 32.13,64.39 32.13,68.58 32,68.71 | JP16.2 29.84,68.71 32,68.71 | JP15.2 38.1,70.74 37.47,71.37 35.31,71.37 34.67,70.74 34.67,69.09 | 34.67,69.09 | 34.67,69.09 34.29,68.71 32,68.71
3.3V  (via drill 0.6)  (27 unrouted)
  Top 0.305: U7.5 15.49,53.34 16,53.85 16,54.74 15.8,54.94 13.39,54.94 13.08,54.63 13.08,54.03 U7.1 13.04,58.63 SG1.+ | C5.2 15.95,33.75 U12.18 v19.05,33.83 | C4.2 13.78,32.4 v13.97,32.05 | C2.2 v29.21,39.37 | R14.2 v15.88,22.86 | R15.2 19.75,19.95 v19.84,19.86 | SJ2.1 v30.53,13.99 | C6.2 v29.16,25.6 | R16.2 v26.42,21.59 | U12.6 26.77,32.95 v27.25,32.46 27.25,31.83 26.85,31.42 25.95,31.42 U12.4 | C1.2 v13.84,40.46 | v26.72,42.75 26.72,43.78 R11.2
  Bottom 0.305: U19.4 8.33,46.84 v8.38,46.84 | U18.5 8.24,33.35 C14.1 7.49,35.04 C15.A 7.62,36.96 7.62,38.1 9.73,38.1 v9.73,39.42
  pour Route15 (no thermals): 41.91,54.61 36.83,54.61 36.88,74.9 1.32,74.9 1.27,1.27 41.91,1.27
A3  (via drill 0.6)
  Top 0.305: U12.26 19.59,25.71 v19.18,25.63
  Bottom 0.305: JP4.12 35.71,22.71 21.57,22.68 v19.18,25.63
A7  (via drill 0.6)
  Top 0.305: U12.22 18.17,30.55 18.29,30.43 18.69,30.43 v19.1,30.02
  Bottom 0.305: v19.1,30.02 20.24,30.02 20.5,29.77 20.5,28.65 20.93,28.22 22.02,28.22 22.84,27.41 22.84,25.2 23.39,24.64 32.05,24.64 32.18,24.66 35.46,24.66 36.12,25.43 36.12,27.41 37.24,28.52 37.19,28.57 37.19,32.89 37.91,33.62 JP4.9
AREF  (via drill 0.6)
  Top 0.305: U12.20 15.58,32.15 v15.29,32.44 15.2,32.44 C3.2
BATT_LVL  (2 unrouted)
  Top 0.305: 30.38,25.85 30.38,26.21 30.12,26.47 27.99,26.47 27.36,27.64 25.58,27.64 23.67,29.62 23.32,29.64 23.32,32.97 23.14,32.97 17.32,32.97 U12.19 | 31.9,25.8 32.6,26.49 36.2,26.49 37.59,28.02 38.66,29.16 38.66,34.59 39.37,35.56 JP4.8
BATT_LVL_DP  (1 unrouted)
  Top 0.305: R17.2 31.88,25.69 R18.1
BT_CS  (via drill 0.6)
  Top 0.305: v34.29,52.07 34.29,55.32 33.83,55.78 32.33,55.78 32.03,55.47 32.03,54.4 U8.23
  Bottom 0.305: JP13.5 34.29,45.64 v34.29,52.07
BT_CTS
  Top 0.305: U8.16 23.67,52.07 SJ1.1
BT_MISO
  Top 0.305: U8.24 33.27,52.58 32.97,52.27 32.97,50.22 JP13.1
BT_MOSI  (via drill 0.6)
  Top 0.305: U8.2 32.13,67.56 32.13,63.12 33.03,62.19 v33.05,56.9
  Bottom 0.305: JP13.4 30.61,48.06 31.8,49.25 31.77,54.28 v33.05,56.9
BT_PWR  (via drill 0.6)
  Top 0.305: U7.6 14.34,53.99 13.99,53.65 14,51.67 | U12.25 18.85,27.4 18.82,26.62 17.45,25.68 v17.48,25.68 | BT_PWR.1 26.19,64.8 25.02,63.63 23.9,63.63 23.5,63.22 23.57,59.79 23.57,59.77 18.92,55.37 18.87,51.69 14,51.67 | v14.5,28.09 11.66,28.07 10.46,29.26 10.44,29.26 10.24,29.46 10.24,33.2 8.38,35.05 8.38,42.75 10.16,44.53 10.89,45.25 R22.1 11.02,49.34 11.02,51.66 14,51.67
  Bottom 0.305: v14.5,28.09 15.06,28.09 v17.48,25.68
BT_RESET  (via drill 0.6)
  Top 0.305: v26.9,56.87 25.93,57.94 25.93,60.65 28.55,62.2 28.55,64.16 28.37,64.52 $$U3.1 28.3,66.29 28.5,66.78 U8.5 | 27.46,29.75 v27.48,29.77 | v27.91,35.41 v27.96,39.17
  Bottom 0.305: v26.9,56.87 26.9,56.29 27.43,55.75 27.38,49.45 27.43,49.4 27.56,49.4 27.56,42.75 28.04,42.22 28.04,39.83 v27.96,39.17 | v27.48,29.77 27.48,29.84 28.19,30.56 28.19,35.13 v27.91,35.41
BT_RTS
  Top 0.305: U8.15 22.47,52.2 SJ1.2
BT_SCK  (via drill 0.6)
  Top 0.305: U8.6 27.25,64.08 27.61,63.73 v27.61,62.97
  Bottom 0.305: JP13.3 31.75,45.72 29.77,45.72 29.11,46.46 29.03,53.65 29.84,55.02 29.77,56.72 28.27,58.27 28.25,61.42 v27.61,62.97
BT_UARTRX
  Top 0.305: U8.13 20.07,53.22 20.07,53.21 20.07,52.96 19.81,52.7 19.81,52.14 R9.2
BT_UARTTX
  Top 0.305: U8.14 21.27,53.02 20.95,52.7 R10.2
BT_VCC  (via drill 0.6)
  Top 0.305: U7.4 14.91,52.7 15.93,52.7 16.64,53.42 16.64,55.88 18.29,55.88 20.37,57.96 20.37,62.61 v21.08,63.32 21.08,63.5 21.84,64.26 24.77,64.26 25.15,64.64 25.15,66.17 25.02,66.29 21.46,66.29 21.34,66.42 21.34,67.12 21.08,67.37 U8.11
  Bottom 0.305: S3.3 S3.4 21.26,63.5 v21.08,63.32
BUZZER  (via drill 0.6)  (1 unrouted)
  Top 0.305: 15.85,28.5 16.38,28.88 17.23,28.88 U12.24 17.3,27.71 v17.4,27.61
  Bottom 0.305: v17.4,27.61 18.11,27.61 19.05,26.67 19.96,26.67 21.21,25.43 21.21,24.84 21.29,24.77 21.34,24.64 22.63,23.34 35.64,23.34 37.41,25.07 37.31,27.08 38.61,28.37 38.61,28.8 39.42,29.62 JP4.11
BUZZER_DP  (1 unrouted)
D1
  Top 0.305: LED4.C R5.1
D4  (1 unrouted)
D5  (via drill 0.6)  (1 unrouted)
  Top 0.305: JP4.4 37.36,43.64 34.37,40.64 26.95,40.64 26.95,36.04 U12.9
  Top 0.406: 40.64,72.36 41.4,71.6 41.43,71.6 v41.91,71.12
  Bottom 0.406: v41.91,71.12 41.91,69.39 40.89,68.38 34.85,68.38 34.29,67.82 34.29,66.67 34.92,66.04 34.92,64.26 34.54,63.88 34.54,53.85 34.92,53.47 35.81,53.47 35.84,45.03 JP4.4
D5_DP  (1 unrouted)
D+  (via drill 0.6)
  Top 0.305: v2.36,60.88 2.36,60.78 1.93,60.35 1.93,42.44 4.72,39.65 4.75,34.06 4.72,34.06 4.45,33.78 4.45,29.64 4.72,29.36 4.72,24.99 1.98,23.9 1.98,21.89 1.98,5.92 v5.93,3.52
  Bottom 0.305: v2.36,60.88 2.44,60.96 X1.D+ | X2.D+ 6.35,3.94 v5.93,3.52
D-  (via drill 0.6)
  Top 0.305: v3.3,59.56 3.3,58.19 2.64,57.53 2.64,42.75 5.41,39.8 v5.18,23.72
  Bottom 0.305: X1.D- 4.05,60.31 v3.3,59.56 | X2.D- 7.01,6.35 5.13,6.35 5.13,7.75 2.62,9.09 1.98,9.12 2.06,23.75 v5.18,23.72
DTR  (via drill 0.6)  (1 unrouted)
  Top 0.305: v24.71,18.14 24.71,20.25 C9.2
  Bottom 0.305: v24.71,18.14 24.71,16.71 25.3,16.33 26.06,15.85 31.14,15.85 31.14,18.44 34.29,21.59 JP10.11
FT/OUT
  Top 0.305: U13.2 10.67,20.02 10.67,16.38 14.22,12.83 14.22,11.68 15.75,10.16 $$U15.1
GND  (via drill 0.6)  (32 unrouted)
  Top 0.305: U8.1 33.02,67.31 33.27,67.31 33.27,65.79 $$U6.1 | R1.1 5.15,65.35 5.82,65.35 6.35,64.82 v6.35,64.77 | R5.2 27.91,72.24 24.43,69.93 JP17.1 | U8.29 15.82,64.06 15.14,63.37 15.14,62.51 v15.21,62.43 15.21,58.45 15.8,57.86 U8.28 | U8.29 | U13.7 U13.8 | U13.6 U13.5 U13.4 | U13.9 U13.10 U13.11 | U13.11 U13.12 U13.13 8.26,8.36 8.31,8.31 10.19,8.31 10.34,8.46 10.36,8.46 10.79,8.89 U13.15 | U13.6 U13.7 | 5.84,20.02 U13.6 | C8.2 30.11,29.83 29.36,30.58 25.91,30.58 | 25.91,30.58 U12.3 | C3.1 12.04,34.98 12.62,35.56 C5.1 12.85,35.58 12.85,36.32 v12.7,36.83 C1.1 | C7.2 30.79,36.22 30.45,36.55 v30.45,36.65 C2.1 30.46,38.09 30.48,38.1 | C6.1 26.02,25.49 v26.75,26.57 | R17.1 30.53,23.08 JP12.1 | U8.12 20.07,65.91 18.21,64.06 U8.29 | U12.21 v19.1,31.32 | U12.5 v24.18,32.18 24.31,32.05 24.31,30.61 24.33,30.58 25.91,30.58 | U7.2 v11.56,53.31 9.63,53.31 9.63,49.24 | U13.11 5.71,8.76 v3.73,6.5 | R12.1 v28.88,41.66 | U13.7 v4.65,16.41
  Top 0.406: JP15.1 LED7.C LED6.C 33.86,70.89 JP16.1 | R6.2 R5.2 | JP18.1 19.05,71.52 LED2.C 21.59,72.91 R4.2 | C4.1 v13.01,29.54 | 25.88,30.48 U12.3
  Bottom 0.305: v6.35,64.77 5.19,63.61 X1.GND 5.16,62.23 3.45,62.23 v3.43,62.2 | U19.GND2 3.15,41.91 3.05,42.02 3.05,43.79 3.86,44.6 3.86,44.63 3.81,44.58 v3.81,44.45 3.81,44.72 U19.6 5.55,44.65 | v4.65,16.41 BAT1.GND 4.52,16.41 | C14.2 9.54,34.56 10.34,35.36 10.34,36.78 C15.C v12.7,36.83 | U18.2 11.46,31.67 12.22,30.91 12.22,29.67 | 12.22,29.67 12.22,28.65 11.56,27.99 10.34,27.99 C13.C | 12.22,29.67 v13.01,29.54 | 26.11,4.99 R20.2 C10.2 25.96,6.41 25.96,7.09 25.45,7.59 22.78,7.59 | U17.2 22.78,7.62 22.78,7.59 | C11.2 24.59,10.16 v24.61,10.13 24.64,10.13 | 22.78,7.59 22.78,6.12 22.66,6.12 22.3,5.77 22.3,5.17 R21.2 22.21,4.05 23.44,3.45 25.12,3.45 v25.4,3.48 25.4,4.42 26.11,5.13 26.06,5.13 | C12.1 28.18,19.7 28.19,19.68 28.19,20.56 JP12.1 | U19.GND1 4.17,54.88 v4.17,54.89 | X2.GND v3.73,6.5
  pour Route2 (no thermals): 41.91,54.61 36.83,54.61 36.83,74.93 1.27,74.93 1.27,1.27 41.91,1.27
HW_RX  (via drill 0.6)
  Top 0.305: R10.1 20.95,48.84 20.95,48.41 16.23,48.41 16.23,37.64 v16.26,37.62 | JP10.7 36.52,18.09 29.39,18.09 27.43,20.04 27.43,21.59 27.38,23.16 23.29,23.16 22.86,23.6 22.86,27.39 U12.30 22.79,30.91 v21.77,31.93
  Bottom 0.305: v21.77,31.93 21.77,37.54 21.74,37.57 v16.26,37.62
HW_TX  (via drill 0.6)
  Top 0.305: R9.1 v19.81,49.38 | U12.31 23.57,25.68 v24.11,25.63 24.11,24.69 24.66,24.13 28.02,24.13 28.02,20.55 29.49,19.07 38.08,19.07 JP10.9
  Bottom 0.305: v24.11,25.63 23.6,26.59 23.55,28.63 22.61,29.57 22.61,32.49 22.61,42.77 20.02,42.77 20.02,45.9 20.57,46.46 20.57,48.9 20.09,49.38 v19.81,49.38
INT0  (via drill 0.6)
  Top 0.305: LED5.A v30.12,71.58 | v25.12,61.65 25.07,57.1 27.28,54.99 U8.19 27.27,53.28 27.2,53.21 25.17,53.21 24.54,52.7 24.49,50.42 26.67,50.42 28.83,48.26 36.96,48.26 39.04,46.61 41.88,46.61 41.91,39.65 JP4.6 37.9,38.18 37.9,29.11 37.39,28.57 37.36,28.57 35.74,26.95 30.5,26.95 30.07,27.51 v28.68,27.51 | U12.32 24.92,27.46 v25.38,26.8
  Bottom 0.305: v30.12,71.58 27.28,71.6 25.12,70.18 v25.12,61.65 | v25.38,26.8 26.24,27.51 v28.68,27.51
INT1  (via drill 0.6)
  Top 0.305: S1.2 6.07,66.9 7.52,65.46 7.52,59.54 9.37,56.41 v9.4,56.39 | U12.1 26.93,28.95 v27.41,28.47 31.5,28.47 32.66,27.53 35.51,27.53 36.93,28.88 36.93,40.59 37.96,41.62 JP4.5
  Top 0.406: S1.1 S1.2 4.37,67.87 3.16,66.66 R1.2
  Bottom 0.305: v27.41,28.47 27.03,28.85 24.26,28.85 23.22,29.9 23.32,32.66 23.32,43.46 22.55,44.12 22.55,44.58 21.08,46.05 21.08,49.78 19.3,51.56 11.3,51.56 9.91,52.96 9.91,55.88 v9.4,56.39
MISO
  Top 0.305: U12.16 18.85,36.1 18.85,38.86 JP2.1
  Bottom 0.305: U19.7 9.72,43.62 11.43,41.91 14.15,41.91 17.07,38.99 JP2.1
MOSI  (via drill 0.6)
  Top 0.305: 19.56,36.08 U12.15 19.61,36.06 19.61,37.8 20.04,37.8 20.04,41.27 21.26,41.27 JP2.4 21.26,42.32 20.8,42.77 17.42,42.77 17.41,42.78 v17.41,47.15
  Bottom 0.305: U19.3 14.98,48.04 14.98,47.23 15.01,47.19 17.4,47.17 v17.41,47.15
N$1  (via drill 0.6)
  Top 0.305: v7.82,53.42 7.82,52.32 6.38,50.88 6.38,41.22 7.19,40.41 7.19,34.04 8.89,32.74 8.87,28.85 12.14,25.78 15.17,25.78 R13.2
  Bottom 0.305: SG1.- 11.51,65.48 10.44,64.41 10.44,59.28 7.57,56.46 7.57,53.67 v7.82,53.42
N$2
  Top 0.305: JP10.5 33.38,13.97 SJ2.2
  Bottom 0.305: JP10.8 JP10.5
N$5
  Top 0.406: LED3.C 21.59,74.41 R4.1
N$7
  Top 0.406: 34.39,74.31 LED6.A R7.2
N$8  (1 unrouted)
N$9
  Top 0.305: LED2.A 17.78,74.44 R3.1
N$11
  Top 0.406: LED1.A R2.1 15.29,74.31 LED1.A
N$38
  Top 0.406: R8.1 LED7.A
PIO3
  Top 0.305: U8.20 28.45,57.23 29.54,59.61 $$U10.1
PIO4  (via drill 0.6)
  Top 0.305: U8.22 30.89,55.68 32.08,57.53 32,61.09 $$U9.1 v27.18,58.42 | R12.2 v33.83,41.66
  Bottom 0.305: S3.2 S3.1 v27.18,58.42 27.18,58.37 28.07,57.48 28.07,43.31 28.75,42.65 33.81,42.65 33.83,42.65 v33.83,41.66
PIO5  (via drill 0.6)
  Top 0.305: $$U11.1 30.48,57.12 29.64,56.26 U8.21 29.67,52.76 28.63,51.71 25.43,51.71 v25.43,51.74 | LED4.A 25.15,72.92 v23.67,71.7
  Bottom 0.305: v23.67,71.7 23.67,69.77 23.04,68.86 23.16,58.19 25.35,56.16 25.35,51.82 v25.43,51.74
PIO6
  Top 0.305: U8.3 30.89,66.06 $$U4.1
PIO7
  Top 0.305: U8.4 29.64,66.45 29.26,65.96 29.29,63.96 $$U5.1
PIO8  (via drill 0.6)  (1 unrouted)
  Top 0.305: U8.31 v19.18,62.87 19.81,63.5 19.81,64.01 21.18,65.38 PIO8.1 | 22.61,71.68 v20.07,71.68
  Bottom 0.305: v19.18,62.87 16.89,63.98 16.89,71.68 v20.07,71.68
PROG
  Bottom 0.305: U17.5 24.16,5.79 R21.1
RESET  (via drill 0.6)
  Top 0.305: JP4.13 40.68,25.62 41.99,24.31 41.99,10.82 41.33,10.16 36.09,10.16 29.92,12.72 27.2,17.63 25.83,17.65 25.63,17.25 25.63,17.07 24.99,16.43 24.26,16.43 24.05,16.64 24.05,16.66 23.42,17.3 23.42,20.26 C9.1 R16.1 22.02,21.61 U12.29 21.99,30.18 v21.74,30.43 | v11.3,40.08 v12.75,46.66
  Bottom 0.305: JP2.5 16.08,46.71 12.8,46.71 v12.75,46.66 | v21.74,30.43 19.41,32.77 16.18,32.77 16.13,32.82 16.13,34.82 14.3,36.65 14.25,36.65 13.64,36.65 13.59,36.7 13.59,39.47 11.91,39.47 arc-90 v11.3,40.08
SCK  (via drill 0.6)
  Top 0.305: 33.01,73.03 arc-90 R7.1 32.36,73 v31.62,71.86 | U12.17 17.3,40.11 JP2.3
  Bottom 0.305: v31.62,71.86 30.73,72.82 17.88,72.82 15.24,72.06 15.24,69.44 14.45,68.66 13.59,68.66 12.8,67.87 12.78,67.87 9.5,64.59 9.5,59.72 6.76,56.97 6.76,54.38 5.61,53.24 4.67,53.24 3.81,52.38 3.81,46.46 4.45,45.81 U19.5 7.53,45.81 8.89,44.45 12.7,44.45 13.97,43.18 13.97,43.16 15.49,41.63 16.41,41.63 18.62,41.63 JP2.3
SCL
  Top 0.305: U12.28 21.19,23.6 19.58,22 18.92,22 18.45,21.52 R15.1 | U13.1 12.06,20.95 12.93,21.82 17.84,21.82 R15.1 | R15.1 18.44,19.66 18.06,19.28 JP5.2
SDA  (via drill 0.6)
  Top 0.305: 12.04,10.31 U13.16 12.06,12.12 v11.96,12.22 | U12.27 20.39,24.76 19.74,24.11 18.57,24.11 18.43,23.97 | R14.1 18.43,23.97 | 18.43,23.97 18.43,24.13 13.03,24.18 v13.03,22.91
  Bottom 0.305: v11.96,12.22 11.96,13.44 13.01,14.48 | 13.01,14.48 13.01,21.23 13.03,21.23 v13.03,22.91 | 13.01,14.48 13.03,14.48 13.89,15.34 14.96,15.34 JP5.1
SS  (via drill 0.6)
  Top 0.305: U12.14 20.37,36.02 v20.37,34.59 | v14.66,37.72 15.6,38.66 15.6,49.1 | 15.6,49.1 15.57,49.07 v13.06,49.07 | SS.1 16.15,49.66 15.6,49.1
  Bottom 0.305: v14.66,37.72 14.66,37.13 15.72,36.07 18.9,36.07 v20.37,34.59 | U19.2 6.25,49.07 v13.06,49.07
SS1  (via drill 0.6)
  Top 0.305: U12.23 15.13,29.75 v15.11,29.77
  Bottom 0.305: 16.18,29.75 15.13,29.75 v15.11,29.77 17.65,29.77 18.49,28.93 19.36,28.93 20.45,27.84 22.02,26.64 22.02,25.12 23.09,24.05 32.77,24.05 35.53,24 36.8,25.12 36.7,27.28 38.02,28.6 37.97,28.65 37.97,30.56 39.03,31.62 JP4.10
STAT  (via drill 0.6)
  Top 0.305: LED1.C 11.43,72.95 7.59,71.65 7.59,68.12 8.36,67.36 8.36,59.64 10.54,57.45 10.54,55.58 8.97,54 8.97,51.94 7.57,50.55 7.57,47.98 7.09,47.5 7.09,41.63 7.8,40.92 7.8,34.65 9.53,32.92 9.53,29.06 11.76,26.82 v12.62,26.85 | v20.19,5.21 23.22,11.1 23.22,15.11 22.28,16.05 v17.3,16.05
  Bottom 0.305: U17.1 20.79,6.67 20.42,6.3 20.42,5.44 v20.19,5.21 | v17.3,16.05 17.04,16.48 17.04,19.99 17.04,20.32 15.24,20.32 v12.62,26.85
SW_RX  (via drill 0.6)
  Top 0.305: U12.12 22,37.39 22.68,38.08 23.93,38.08 v24.18,38.33 | v36.3,20.42 36.3,22.63 v33.35,25.58
  Bottom 0.305: v33.35,25.58 29.62,29.26 29.62,29.31 28.96,29.97 28.96,36.14 28.83,36.27 28.5,36.47 24.59,36.5 24.59,37.92 v24.18,38.33 | v36.3,20.42 36.3,13.74 37.39,12.65 39.32,12.65 JP10.6
SW_TX  (via drill 0.6)
  Top 0.305: v34.87,25.6 36.45,25.63 39.29,22.86 39.37,22.86 39.37,12.7 JP10.4 | 21.08,36.15 arc90 U12.13 21.19,37.84 21.18,37.85 21.74,37.85 22.5,38.61 22.5,39.47 24.99,39.47 v25.04,39.52
  Bottom 0.305: v34.87,25.6 34.11,26.7 33.05,26.7 33.02,26.67 29.72,29.97 29.77,35.66 29.44,36.25 29.44,36.75 29.41,36.75 29.01,37.16 25.35,37.16 25.35,39.22 v25.04,39.52
VBAT  (via drill 0.6)
  Top 0.305: 9.5,20.17 U13.3 | U13.3 9.53,16.26 13.31,12.47 13.31,9.25 13.89,8.53 14.83,8.53 v18.77,8.23 | v26.54,16.76 26.42,15.95 25.59,15.06 JP7.5 | R18.2 31.9,23.71 JP12.2 | v6.71,31.67 8.15,31.67 8.18,28.65 11.46,25.68 11.43,22.28 9.53,22.25 U13.3
  Bottom 0.305: S2.2 5.54,32.56 v6.71,31.67 | v26.54,16.76 27.29,18.4 C12.2 27.95,18.39 29.87,18.39 29.87,18.44 31.37,19.94 31.37,21.7 JP12.2 | v18.77,8.23 19.11,8.57 U17.3 21.56,10.13 21.59,10.16 C11.1 JP7.5
VBAT_RTC  (via drill 0.6)
  Top 0.305: U13.14 9.53,12.09 v9.53,13.11
  Bottom 0.305: BAT1.PWR@1 8.89,24.13 10.41,24.11 10.41,13.13 v9.53,13.11
VBAT_SW
  Bottom 0.305: S2.3 5.87,29.56 C13.A | C13.A 7.49,27.18 | JP7.3 20.22,14.73 19.89,15.06 19.05,15.06 19.05,19.05 16.94,21.61 16.94,23.72 13.44,27.23 13.44,28.5 13.97,29.03 13.97,30.3 11.71,32.59 U18.1 9.27,32.62 9.27,30.73 | 9.27,30.73 9.27,29.59 9.14,29.59 C13.A | U18.3 9.28,30.72 9.27,30.73
VBUS  (via drill 0.6)
  Top 0.305: v10.24,25.25 5.84,25.25 5.82,30 5.84,30.1 5.84,32.74 6.3,33.2 6.3,40.31 5.71,40.89 5.71,55.52 v4.6,56.62 | R2.2 16.51,72.44 15.72,71.65 v14.3,71.65
  Top 0.406: R3.2 R2.2
  Bottom 0.305: C10.1 27.32,7.59 R19.1 26.31,7.62 25.38,8.56 | 25.38,8.56 U17.4 | X1.VBUS 6.52,59.66 | 6.52,59.66 6.55,59.69 6.55,59.74 8,61.19 8,70.64 8.76,71.4 v14.3,71.65 | 6.52,59.66 6.52,57.68 5.59,56.74 v4.6,56.62 | 10.94,6.51 10.81,6.34 7.67,6.33 7.67,5.21 X2.VBUS | 10.94,6.51 15.29,12.01 20.95,11.96 JP7.4 23.62,15.16 25.7,15.16 25.68,10.74 25.68,8.87 25.38,8.56 | v10.24,25.25 11.02,25.22 10.94,6.51
WALL  (via drill 0.6)  (1 unrouted)
  Top 0.305: U12.11 22.87,36.12 22.87,37.47 25.07,37.47 25.86,37.47 25.93,37.54 25.93,40.74 v25.17,40.74
  Bottom 0.305: 28.07,5.08 28.55,5.56 | 28.55,5.56 28.55,7.58 | 28.55,5.56 32.84,7.62 41.25,7.62 41.91,8.28 41.96,37.57 40.64,37.57 JP4.7 36.88,37.62 36.88,37.57 35.56,39.37 31.75,39.37 30.48,38.1 26.9,38.12 26.9,39.01 26.9,40.74 v25.17,40.74
WALL_DP  (2 unrouted)
XTAL1
  Top 0.305: Q1.1 33.15,30.61 32.69,31.06 31.82,31.06 C8.1 31.75,32.18 30.18,33.76 U12.7
XTAL2
  Top 0.305: U12.8 31.39,34.55 C7.1 33.77,34.91 Q1.2

### Text on the board
tPlace: 1 | SS | VCC | VCC | GND | GND | GND | 1WB | 5 | 6 | D5 | 4 | INT1 | INT1 | 3 | 1 | INT0 | 2 | WAL | BLV | A7 | ON | SS1 | BZ | A3 | RST | DTR | 1 | - + | GND | I2C | HTX | HRX | PWR | DV+ | SRX | 1 | GND | FT/OUT | GND | STX | GND | FoneAstra 3.1 UW/CSE
bPlace: BPWR | BRST | PIO6 | PIO8 | GND | PIO7 | PIO4 | PIO3 | PIO5 | BT MODULE | SS | 1 | VCC | GND | 5 | 1WB | GND | 6 | D5 | 4 | INT1 | 3 | 1 | 2 | INT0 | WAL | BLV | A7 | SS1 | BZ | A3 | RST | DTR | 1 | HTX | GND | HRX | DV+ | SRX | 1 | GND | STX | FT/OUT | GND | GND | FoneAstra 3.1 UW/CSE